# Altium schematic sheet 02_ETHERNET.SchDoc: =GlobalProjectName
size 594 x 420 mm; CheckedBy: A_D; Author: A_D; SheetNumber: 2; SheetTotal: 3; PageSetup: Record=PageOptions|CenterHorizontal=True|CenterVertical=True|PrintScale=0.70|XCorrection=1.00|YCorrection=1.00|PrintKind=2|BorderSize=5000000|LeftOffset=9000|BottomOffset=10100|Orientation=2|PaperLength=11176|PaperWidth=8636|Scale=100|PaperSource=259|PrintQuality=-3|MediaType=1|DitherType=10|PrintScaleMode=1|PaperKind=A3|PaperIndex=8
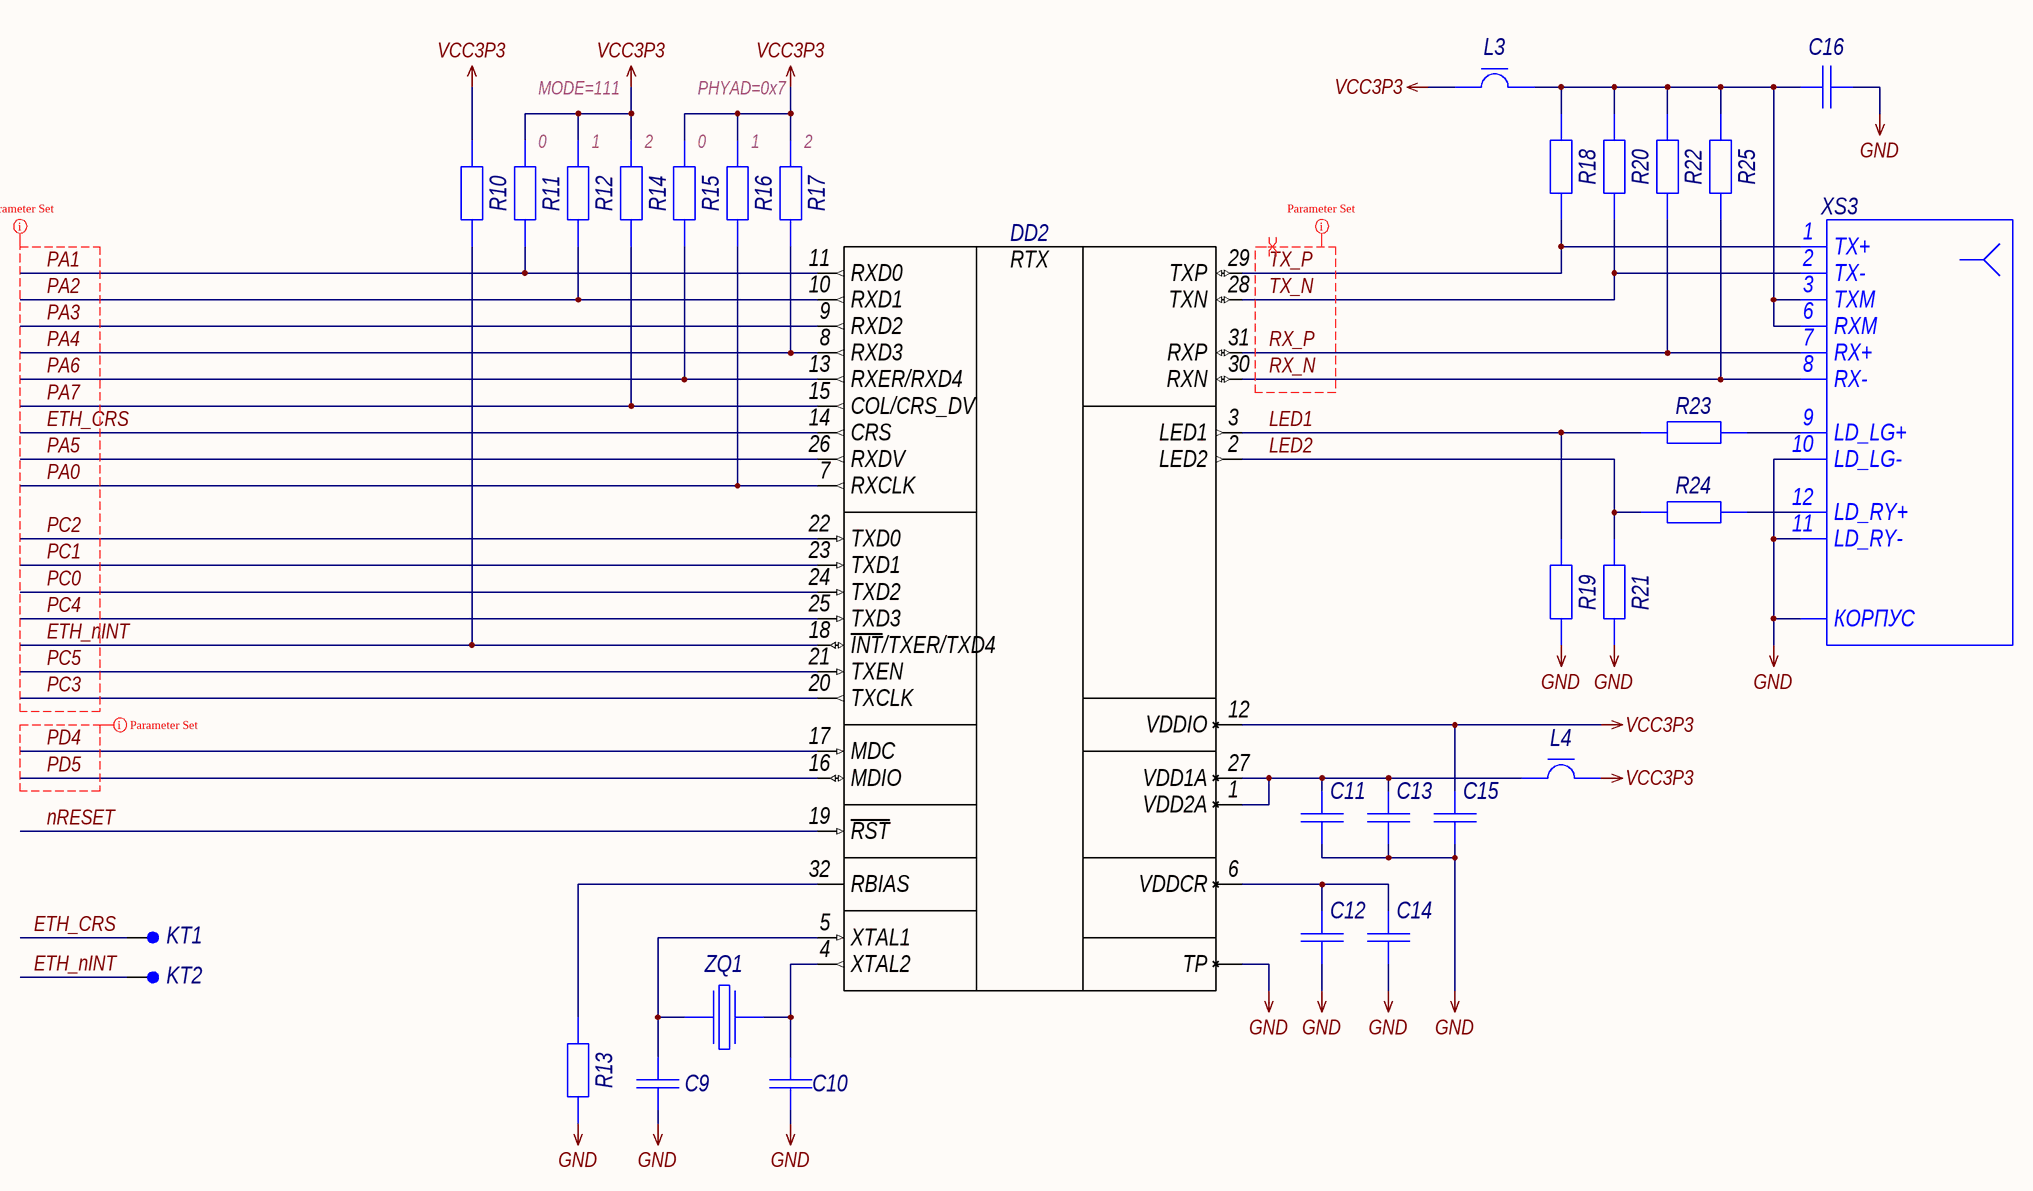
[diagram p0: 02_ETHERNET.SchDoc]

## Parts
C9  Capacitor  [C0603_L]  (value not drawn)
C10  Capacitor  [C0603_L]  (value not drawn)
C11  Capacitor  [C0603_L]  (value not drawn)
C12  Capacitor  [C0603_L]  (value not drawn)
C13  Capacitor  [C0603_L]  (value not drawn)
C14  Capacitor  [C0603_L]  (value not drawn)
C15  Capacitor  [C0603_L]  (value not drawn)
C16  Capacitor  [C0603_L]  (value not drawn)
DD2  LAN8710A-Series  [QFN-32_050P500X500X085_N]  (value not drawn)
KT1  Text  [TP-SMT-C-0.8mm]  (value not drawn)  (no BOM)
KT2  Text  [TP-SMT-C-0.8mm]  (value not drawn)  (no BOM)
L3  FerriteBead  [L0603_L]  (value not drawn)
L4  FerriteBead  [L0603_L]  (value not drawn)
R10  Resistor  [R0603_L]  (value not drawn)
R11  Resistor  [R0603_L]  (value not drawn)
R12  Resistor  [R0603_L]  (value not drawn)
R13  Resistor  [R0603_L]  (value not drawn)
R14  Resistor  [R0603_L]  (value not drawn)
R15  Resistor  [R0603_L]  (value not drawn)
R16  Resistor  [R0603_L]  (value not drawn)
R17  Resistor  [R0603_L]  (value not drawn)
R18  Resistor  [R0603_L]  (value not drawn)
R19  Resistor  [R0603_L]  (value not drawn)
R20  Resistor  [R0603_L]  (value not drawn)
R21  Resistor  [R0603_L]  (value not drawn)
R22  Resistor  [R0603_L]  (value not drawn)
R23  Resistor  [R0603_L]  (value not drawn)
R24  Resistor  [R0603_L]  (value not drawn)
R25  Resistor  [R0603_L]  (value not drawn)
XS3  Text  [SK02-111006NL]  (value not drawn)
ZQ1  Crystal  [SMD 5x3.2mm]  (value not drawn)

## Nets
GND: C9.1 C10.1 C11.1 C12.1 C13.1 C14.1 C15.1 C16.2 DD2.TP R13.1 R19.1 R21.1 XS3.10(LD_LG-) XS3.11(LD_RY-) XS3.CASE(КОРПУС)
VCC3P3: C15.2 DD2.12(VDDIO) L3.1 L4.2 R10.2 R11.2 R12.2 R14.2 R15.2 R16.2 R17.2
ETH_CRS: DD2.14(CRS) KT1.1
ETH_nINT: DD2.18(~{INT}/TXER/TXD4) KT2.1 R10.1
LED1: DD2.3(LED1) R19.2 R23.1
LED2: DD2.2(LED2) R21.2 R24.1
nRESET: DD2.19(~{RST})
PA0: DD2.7(RXCLK) R16.1
PA1: DD2.11(RXD0) R11.1
PA2: DD2.10(RXD1) R12.1
PA3: DD2.9(RXD2)
PA4: DD2.8(RXD3) R17.1
PA5: DD2.26(RXDV)
PA6: DD2.13(RXER/RXD4) R15.1
PA7: DD2.15(COL/CRS_DV) R14.1
PC0: DD2.24(TXD2)
PC1: DD2.23(TXD1)
PC2: DD2.22(TXD0)
PC3: DD2.20(TXCLK)
PC4: DD2.25(TXD3)
PC5: DD2.21(TXEN)
PD4: DD2.17(MDC)
PD5: DD2.16(MDIO)
RX_N: DD2.30(RXN) R25.1 XS3.8(RX-)
RX_P: DD2.31(RXP) R22.1 XS3.7(RX+)
TX_N: DD2.28(TXN) R20.1 XS3.2(TX-)
TX_P: DD2.29(TXP) R18.1 XS3.1(TX+)
NetC9_2: C9.2 DD2.5(XTAL1) ZQ1.1
NetC10_2: C10.2 DD2.4(XTAL2) ZQ1.3
NetC11_2: C11.2 C13.2 DD2.1(VDD2A) DD2.27(VDD1A) L4.1
NetC12_2: C12.2 C14.2 DD2.6(VDDCR)
NetC16_1: C16.1 L3.2 R18.2 R20.2 R22.2 R25.2 XS3.3(TXM) XS3.6(RXM)
NetDD2_32: DD2.32(RBIAS) R13.2
NetR23_2: R23.2 XS3.9(LD_LG+)
NetR24_2: R24.2 XS3.12(LD_RY+)

## Layout directives
net class MII; rule Matched Net Lengths [Tolerance = 2mm]: ETH_CRS, ETH_nINT, PA0, PA1, PA2, PA3, PA4, PA5, PA6, PA7, PC0, PC1, PC2, PC3, PC4, PC5
net class SMI; rule Matched Net Lengths [Tolerance = 2mm]: PD4, PD5
differential pair: RX_N, RX_P, TX_N, TX_P
net class ETH; rule Matched Net Lengths [Tolerance = 1mm]; rule Matched Net Lengths [Tolerance = 2mm]: RX_N, RX_P, TX_N, TX_P

## Notes on the sheet
- MODE=111
- PHYAD=0x7
- (near R11) 0
- (near R12) 1
- (near R14) 2
- (near R15) 0
- (near R16) 1
- (near R17) 2
- Подп. и дата
- Инв. № дубл.
- Взам. инв. №
- Инв. № подл.
- Изм.
- Лист
- № докум.
- Подп.
- Дата
- Форма 2а ГОСТ 2.104-2006
- Копировал
- Формат А2
- (in symbol LAN8710A-EZC) RTX

## Library data of the parts
C9 C10 = GCM1885C2A120JA16D: Manufacturer: Murata; Type: Конденсатор; ID: 121; Value: 12pF; Voltage: 100V; Tolerance: ±5%; Dielectric Type: NP0; Application Category: 1; Working Temperature Min: -55°С; Working Temperature Max: +125°С; Published: 18.05.2010; Publisher: Andrew Danich; Part Number: GCM1885C2A120JA16D; Footprint: 0603
C11 C13 C15 C16 = GRM188R72A104KA35D: Manufacturer: Murata; Type: Конденсатор; ID: 232; Value: 0.1uF; Voltage: 100V; Tolerance: ±10%; Dielectric Type: X7R; Application Category: 1; Working Temperature Min: -55°С; Working Temperature Max: +125°С; Published: 18.05.2010; Publisher: Andrew Danich; Part Number: GRM188R72A104KA35D; Footprint: 0603
C12 = GCM188R71E105KA64D: Manufacturer: Murata; Type: Конденсатор; ID: 134; Value: 1uF; Voltage: 25V; Tolerance: ±10%; Dielectric Type: X7R; Application Category: 1; Working Temperature Min: -55°С; Working Temperature Max: +85°С; Published: 18.05.2010; Publisher: Andrew Danich; Part Number: GCM188R71E105KA64D; Footprint: 0603
C14 = GRM1885C1H471FA01D: Manufacturer: Murata; Type: Конденсатор; ID: 137; Value: 470pF; Voltage: 50V; Tolerance: ±1%; Dielectric Type: NP0; Application Category: 1; Working Temperature Min: -55°С; Working Temperature Max: +125°С; Published: 18.05.2010; Publisher: Andrew Danich; Part Number: GRM1885C1H471FA01D; Footprint: 0603
DD2 = LAN8710A-EZC: Manufacturer: Microchip; ID: 5; Supply Operation: +3.3V; Ethernet Speed: 10/100BASE-T; Interface: MII, RMII; Application Category: 1; Working Temperature Min: 0°С; Working Temperature Max: +85°С; Functional Analog: LAN8710A-EZC-ABC, LAN8710Ai-EZK; Type: Микросхема; Published: 01.09.2018; Publisher: Andrew Danich; Part Number: LAN8710A-EZC; Value: LAN8710A-EZC
KT1 KT2 = TestPoint-SMT: ID: 6; Application Type: On PCB Test Point; Application Category: 1; Published: 03.03.2015; Publisher: Andrew Danich; Part Number: TestPoint-SMT; Value: TestPoint-SMT; Manufacturer: -; Functional Analog: -
L3 L4 = BLM18PG331SN1: Manufacturer: Murata; Type: Дроссель; ID: 1; Rated Current: 1.2A; Impedance at 100Mhz: 330ohm; DC Resistance: 0.15ohm; Inductor Type: EMIFIL; Working Temperature Min: -55°С; Working Temperature Max: +125°С; Published: 14.11.2014; Publisher: Andrew Danich; Part Number: BLM18PG331SN1; Value: BLM18PG331SN1; Footprint: 0603; Application Category: 1
R10-R12 R14-R17 R19 R21 = RC0603JR-0710KL: Manufacturer: Yageo; ID: 12; Value: 10k; Limit Voltage: 50V; Tolerance: ±5%; Temperature Coefficient: 100ppm; Total Power Dissipation: 0.1W; Series Type: Thick-Film; Application Category: 1; Working Temperature Min: -55°С; Working Temperature Max: +155°С; Functional Analog: CR0603-JW-103E; Published: 24.03.2010; Publisher: Andrew Danich; Type: Резистор; Part Number: RC0603JR-0710KL; Footprint: 0603
R13 = RC0603FR-0712KL: Manufacturer: Yageo; ID: 323; Value: 12k; Limit Voltage: 50V; Tolerance: ±1%; Temperature Coefficient: 100ppm; Total Power Dissipation: 0.1W; Series Type: Thick-Film; Application Category: 1; Working Temperature Min: -55°С; Working Temperature Max: +155°С; Published: 24.03.2010; Publisher: Andrew Danich; Type: Резистор; Part Number: RC0603FR-0712KL; Footprint: 0603
R18 R20 R22 R25 = RC0603FR-0749R9L: Manufacturer: Yageo; ID: 249; Value: 49.9; Limit Voltage: 50V; Tolerance: ±1%; Temperature Coefficient: 100ppm; Total Power Dissipation: 0.1W; Series Type: Thick-Film; Application Category: 1; Working Temperature Min: -55°С; Working Temperature Max: +155°С; Functional Analog: CR0603-FX-49R9E; Published: 24.03.2010; Publisher: Andrew Danich; Type: Резистор; Part Number: RC0603FR-0749R9L; Footprint: 0603
R23 R24 = RC0603JR-07270RL: Manufacturer: Yageo; ID: 36; Value: 270; Limit Voltage: 50V; Tolerance: ±5%; Temperature Coefficient: 100ppm; Total Power Dissipation: 0.1W; Series Type: Thick-Film; Application Category: 1; Working Temperature Min: -55°С; Working Temperature Max: +155°С; Published: 24.03.2010; Publisher: Andrew Danich; Type: Резистор; Part Number: RC0603JR-07270RL; Footprint: 0603
XS3 = SK02-111006NL: Manufacturer: Sanken Electric Co., Ltd; ID: 18; Limit Voltage: 125V; Limit Current: 1.5A; Connector Type: Female; Interface: Ethernet/Int.Trans.; Max Data Rate: 10/100Mbs; Application Category: 1; Working Temperature Min: -40°С; Working Temperature Max: +70°С; Value: SK02-111006NL; Published: 08.09.2014; Publisher: Andrew Danich; Type: Розетка; Part Number: SK02-111006NL; Pins: 12; Mount Type: Through hole; Functional Analog: -
ZQ1 = AB-25.000MAGE-T: Manufacturer: TXC Corporation; ID: 26; Output Frequency: 25MHz; Load Capacitance: 12pF; Temperature Coefficient: ±30ppm; Application Category: 1; Working Temperature Min: -40°С; Working Temperature Max: +85°С; Published: 08.03.2013; Publisher: Andrew Danich; Type: Резонатор; Part Number: AB-25.000MAGE-T; Value: AB-25.000MAGE-T